# Altium schematic sheet Peripheral.SchDoc
size A3; SheetNumber: 5; SheetTotal: 6; ProjectTitle: PD_SMARTKEY_EMN-EVAN_V2
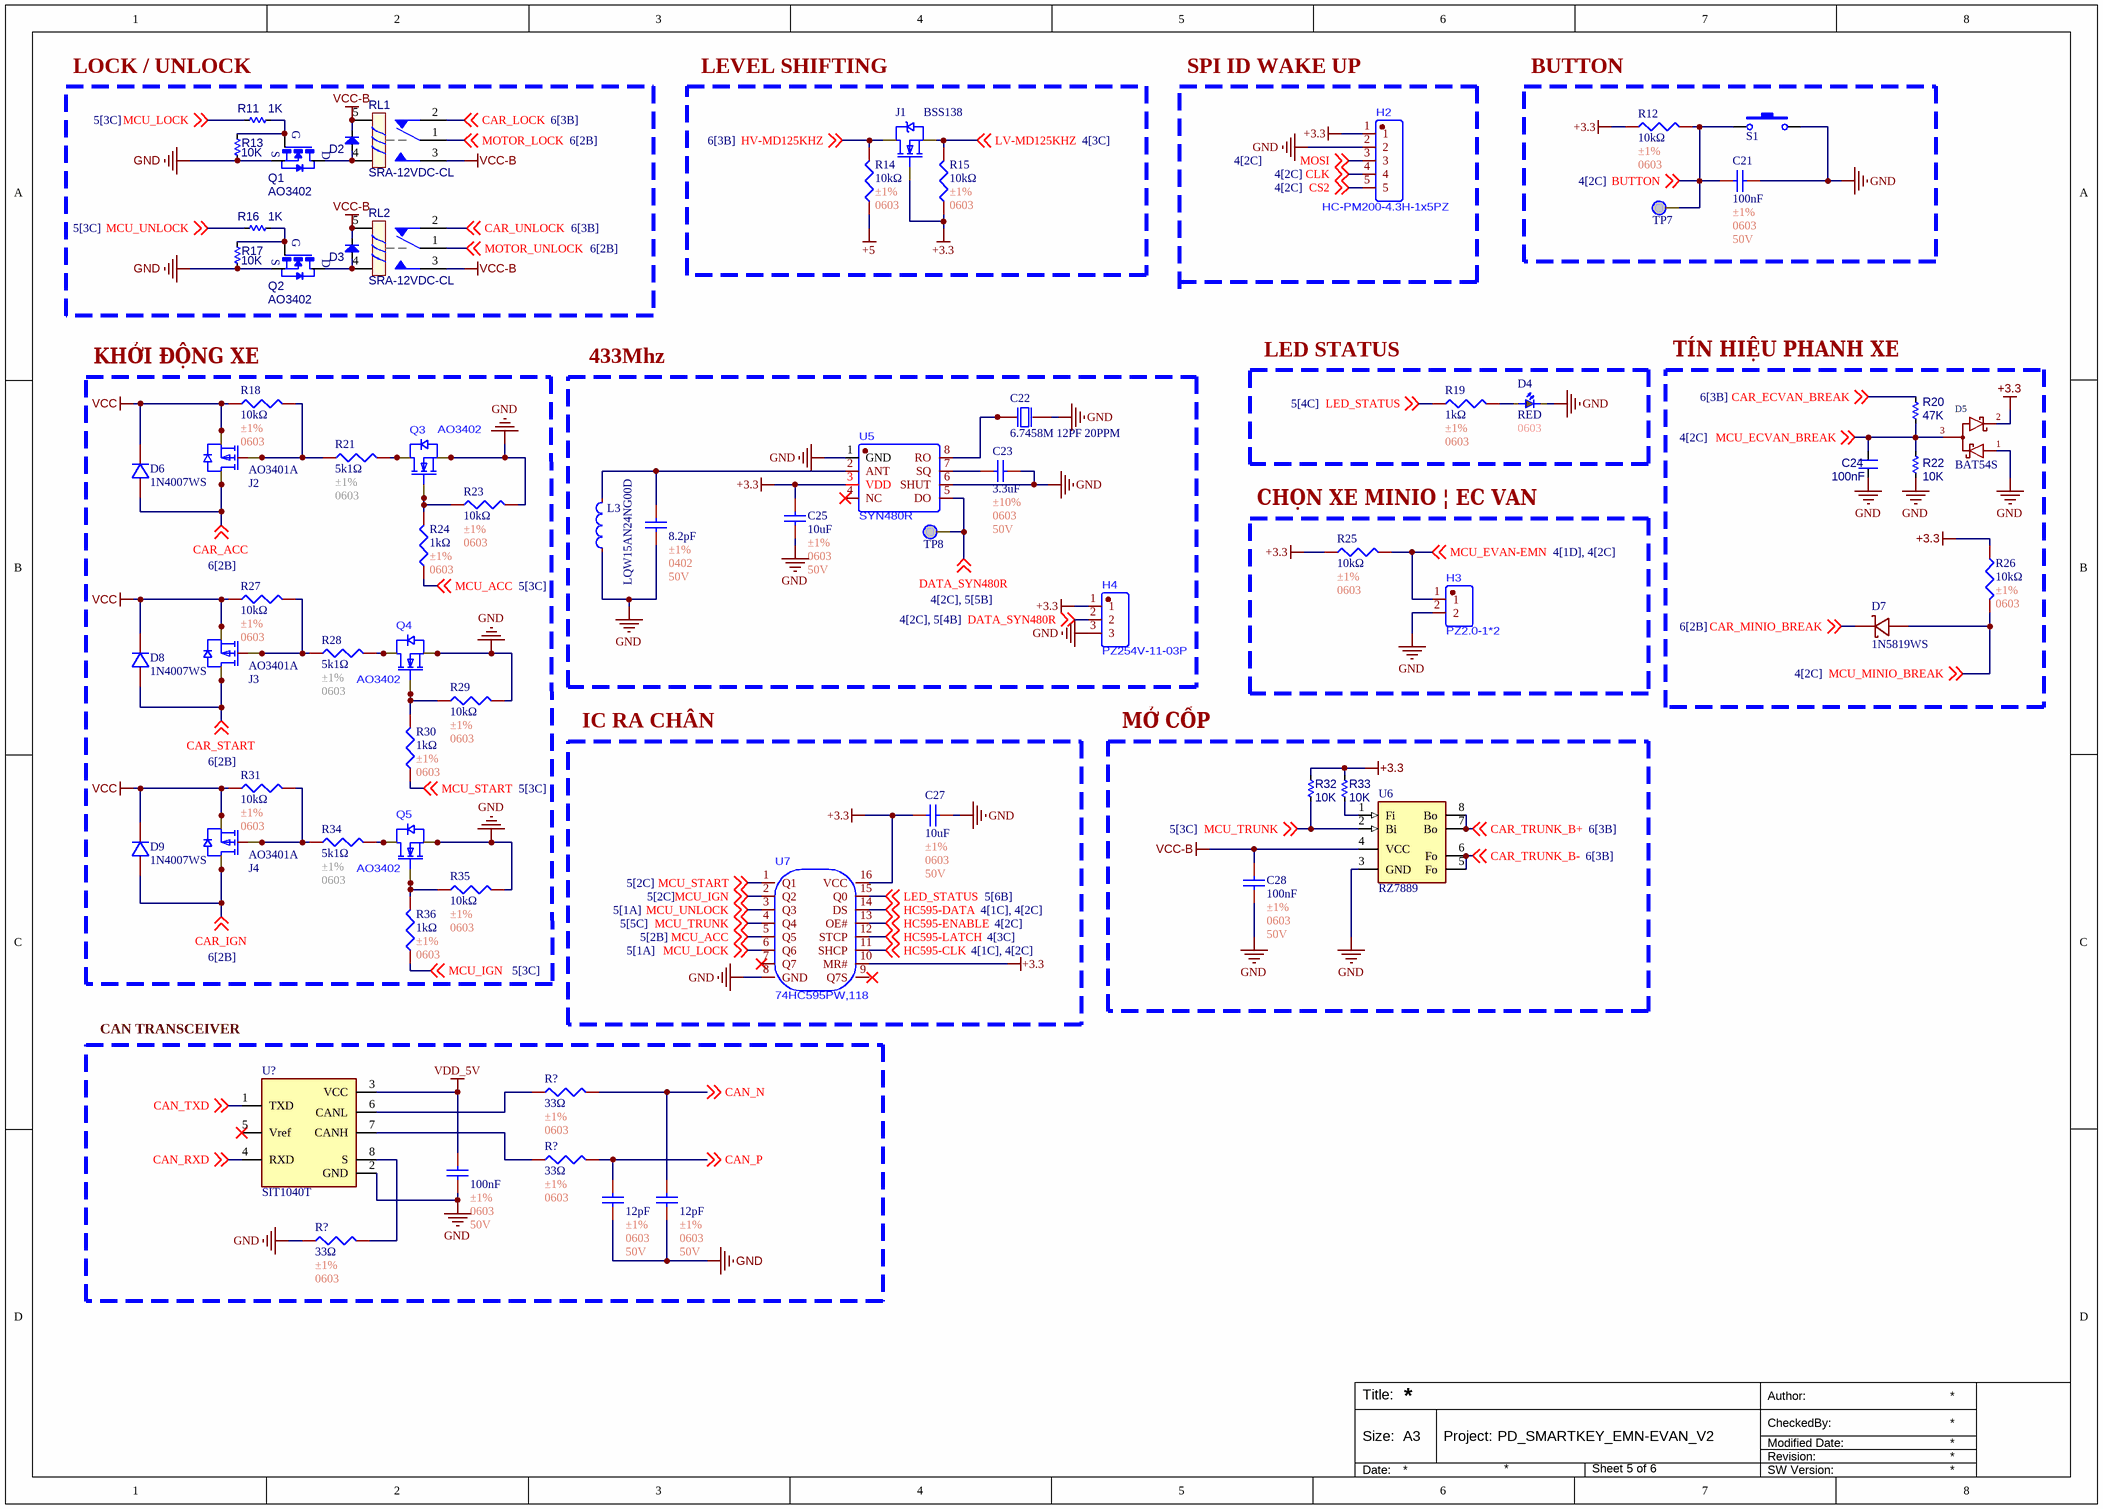
[diagram p0: Peripheral.SchDoc]

## Parts
(Parts that share a designator on the sheet are numbered #1, #2 ... from top to bottom, then left to right.)
C21  100nF  Tolerance: ±1%  Package: 0603  Voltage Rating: 50V  [C0603]
C22  6.7458M 12PF 20PPM  [6.7458M 12PF 20PPM]
C23  3.3uF  Tolerance: ±10%  Package: 0603  Voltage Rating: 50V  [C0603]
C24  100nF  [C-0603]
C25  10uF  Tolerance: ±1%  Package: 0603  Voltage Rating: 50V  [C0603]
C26  8.2pF  Tolerance: ±1%  Package: 0402  Voltage Rating: 50V  [C0402]
C27  10uF  Tolerance: ±1%  Package: 0603  Voltage Rating: 50V  [C0603]
C28  100nF  Tolerance: ±1%  Package: 0603  Voltage Rating: 50V  [C0603]
C?#1  100nF  Tolerance: ±1%  Package: 0603  Voltage Rating: 50V  [C0603]
C?#2  12pF  Tolerance: ±1%  Package: 0603  Voltage Rating: 50V  [C0603]
C?#3  12pF  Tolerance: ±1%  Package: 0603  Voltage Rating: 50V  [C0603]
D2  1N5819  [SOD-323]  (value not drawn)
D3  1N5819  [SOD-323]  (value not drawn)
D4  RED  Package: 0603  [LED0603]
D5  BAT54S  [SOT23-3]
D6  1N4007WS  [1N4007WS]
D7  1N5819WS  [1N5819WS]
D8  1N4007WS  [1N4007WS]
D9  1N4007WS  [1N4007WS]
H2  HC-PM200-4.3H-1x5PZ  [JC_5P_XH2.0]
H3  PZ2.0-1*2  [JC_2P_XH2.0]
H4  PZ254V-11-03P  [PZ254V-11-03P]
J1  BSS138  [BSS138]
J2  AO3401A  [AO3401]
J3  AO3401A  [AO3401]
J4  AO3401A  [AO3401]
L3  LQW15AN24NG00D  [LQW15AN24NG00D]
Q1  AO3402  [SOT23-3]
Q2  AO3402  [SOT23-3]
Q3  AO3402  [AO3402]
Q4  AO3402  [AO3402]
Q5  AO3402  [AO3402]
R11  1K  [RES-SMD-0603]
R12  10kΩ  Tolerance: ±1%  Package: 0603  [R0603]
R13  10K  [RES-SMD-0603]
R14  10kΩ  Tolerance: ±1%  Package: 0603  [R0603]
R15  10kΩ  Tolerance: ±1%  Package: 0603  [R0603]
R16  1K  [RES-SMD-0603]
R17  10K  [RES-SMD-0603]
R18  10kΩ  Tolerance: ±1%  Package: 0603  [R0603]
R19  1kΩ  Tolerance: ±1%  Package: 0603  [R0603]
R20  47K  [RES-SMD-0603]
R21  5k1Ω  Tolerance: ±1%  Package: 0603  [R0603]
R22  10K  [RES-SMD-0603]
R23  10kΩ  Tolerance: ±1%  Package: 0603  [R0603]
R24  1kΩ  Tolerance: ±1%  Package: 0603  [R0603]
R25  10kΩ  Tolerance: ±1%  Package: 0603  [R0603]
R26  10kΩ  Tolerance: ±1%  Package: 0603  [R0603]
R27  10kΩ  Tolerance: ±1%  Package: 0603  [R0603]
R28  5k1Ω  Tolerance: ±1%  Package: 0603  [R0603]
R29  10kΩ  Tolerance: ±1%  Package: 0603  [R0603]
R30  1kΩ  Tolerance: ±1%  Package: 0603  [R0603]
R31  10kΩ  Tolerance: ±1%  Package: 0603  [R0603]
R32  10K  [RES-SMD-0603]
R33  10K  [RES-SMD-0603]
R34  5k1Ω  Tolerance: ±1%  Package: 0603  [R0603]
R35  10kΩ  Tolerance: ±1%  Package: 0603  [R0603]
R36  1kΩ  Tolerance: ±1%  Package: 0603  [R0603]
R?#1  33Ω  Tolerance: ±1%  Package: 0603  [R0603]
R?#2  33Ω  Tolerance: ±1%  Package: 0603  [R0603]
R?#3  33Ω  Tolerance: ±1%  Package: 0603  [R0603]
RL1  SRA-12VDC-CL  [YL318-DC12V-C]
RL2  SRA-12VDC-CL  [YL318-DC12V-C]
S1  SW-SMD  [SW-SMD]  (value not drawn)
TP7  TP  [TP]  (value not drawn)
TP8  TP  [TP]  (value not drawn)
U5  SYN480R  [SYN480R]
U6  RZ7889  [SO8]
U7  74HC595PW,118  [74HC595PW,118]
U?  SIT1040T  [SO8]

## Blocks framed on the sheet
LOCK / UNLOCK: D2 D3 Q1 Q2 R11 R13 R16 R17 RL1 RL2
LEVEL SHIFTING: J1 R14 R15
BUTTON: C21 R12 S1 TP7
KHỞI ĐỘNG XE: D6 D8 D9 J2-J4 Q3-Q5 R18 R21 R23 R24 R27-R31 R34-R36
433Mhz: C22 C23 C25 C26 H4 L3 TP8 U5
TÍN HIỆU PHANH XE: C24 D5 D7 R20 R22 R26
CHỌN XE MINIO | EC VAN: H3 R25
IC RA CHÂN: C27 U7
MỞ CỐP: C28 R32 R33 U6
CAN TRANSCEIVER: C?#1-C?#3 R?#1-R?#3 U?

## Nets
+3.3: C25.1 C27.1 D5.2(C) H2.1 H4.1 J1.1(G) R12.1 R15.1 R25.1 R26.1 R32.1 R33.1 U5.3(VDD) U7.10(MR#) U7.16(VCC)
+5: R14.1
GND: C21.1 C22.2(OSC2) C23.1 C24.1 C25.2 C26.2 C27.2 C28.2 C?#1.2 C?#2.2 C?#3.2 D4.1 D5.1(A) H2.2 H3.2 H4.3 L3.1 Q1.2(S) Q2.2(S) Q3.2(S) Q4.2(S) Q5.2(S) R13.1 R17.1 R22.1 R23.2 R29.2 R35.2 R?#3.1 S1.2 U5.1(GND) U5.6(SHUT) U6.3(GND) U7.8(GND) U?.2(GND)
VCC: D6.1(K) D8.1(K) D9.1(K) J2.2(S) J3.2(S) J4.2(S) R18.1 R27.1 R31.1
VCC-B: C28.1 D2.2(K) D3.2(K) RL1.3 RL1.5 RL2.3 RL2.5 U6.4(VCC)
VDD_5V: C?#1.1 U?.3(VCC)
BUTTON: C21.2 R12.2 S1.1 TP7.1 ; off-sheet BUTTON
CAN_N: C?#3.1 R?#1.2 ; off-sheet CAN_N
CAN_P: C?#2.1 R?#2.2 ; off-sheet CAN_P
CAN_RXD: U?.4(RXD) ; off-sheet CAN_RXD
CAN_TXD: U?.1(TXD) ; off-sheet CAN_TXD
CAR_ACC: D6.2(A) J2.3(D) ; off-sheet CAR_ACC
CAR_ECVAN_BREAK: R20.2 ; off-sheet CAR_ECVAN_BREAK
CAR_IGN: D9.2(A) J4.3(D) ; off-sheet CAR_IGN
CAR_LOCK: RL1.2 ; off-sheet CAR_LOCK
CAR_MINIO_BREAK: D7.1(K) ; off-sheet CAR_MINIO_BREAK
CAR_START: D8.2(A) J3.3(D) ; off-sheet CAR_START
CAR_TRUNK_B+: U6.7(Bo) U6.8(Bo) ; off-sheet CAR_TRUNK_B+
CAR_TRUNK_B-: U6.5(Fo) U6.6(Fo) ; off-sheet CAR_TRUNK_B-
CAR_UNLOCK: RL2.2 ; off-sheet CAR_UNLOCK
CLK: H2.4 ; off-sheet CLK
CS2: H2.5 ; off-sheet CS2
DATA_SYN480R: H4.2 TP8.1 U5.5(DO) ; off-sheet DATA_SYN480R
HC595-CLK: U7.11(SHCP) ; off-sheet HC595-CLK
HC595-DATA: U7.14(DS) ; off-sheet HC595-DATA
HC595-ENABLE: U7.13(OE#) ; off-sheet HC595-ENABLE
HC595-LATCH: U7.12(STCP) ; off-sheet HC595-LATCH
HV-MD125KHZ: J1.3(D) R14.2 ; off-sheet HV-MD125KHZ
LED_STATUS: R19.1 U7.15(Q0) ; off-sheet LED_STATUS
LV-MD125KHZ: J1.2(S) R15.2 ; off-sheet LV-MD125KHZ
MCU_ACC: R24.1 U7.5(Q5) ; off-sheet MCU_ACC
MCU_ECVAN_BREAK: C24.2 D5.3 R20.1 R22.2 ; off-sheet MCU_ECVAN_BREAK
MCU_EVAN-EMN: H3.1 R25.2 ; off-sheet MCU_EVAN-EMN
MCU_IGN: R36.1 U7.2(Q2) ; off-sheet MCU_IGN
MCU_LOCK: R11.2 U7.6(Q6) ; off-sheet MCU_LOCK
MCU_MINIO_BREAK: D7.2(A) R26.2 ; off-sheet MCU_MINIO_BREAK
MCU_START: R30.1 U7.1(Q1) ; off-sheet MCU_START
MCU_TRUNK: R32.2 U6.2(Bi) U7.4(Q4) ; off-sheet MCU_TRUNK
MCU_UNLOCK: R16.2 U7.3(Q3) ; off-sheet MCU_UNLOCK
MOSI: H2.3 ; off-sheet MOSI
MOTOR_LOCK: RL1.1 ; off-sheet MOTOR_LOCK
MOTOR_UNLOCK: RL2.1 ; off-sheet MOTOR_UNLOCK
NetC22_1: C22.1(OSC1) U5.8(RO)
NetC23_2: C23.2 U5.7(SQ)
NetC26_1: C26.1 L3.2 U5.2(ANT)
NetD2_1: D2.1(A) Q1.3(D) RL1.4
NetD3_1: D3.1(A) Q2.3(D) RL2.4
NetD4_2: D4.2 R19.2
NetJ2_1: J2.1(G) R18.2 R21.1
NetJ3_1: J3.1(G) R27.2 R28.1
NetJ4_1: J4.1(G) R31.2 R34.1
NetQ1_1: Q1.1(G) R11.1 R13.2
NetQ2_1: Q2.1(G) R16.1 R17.2
NetQ3_1: Q3.1(G) R23.1 R24.2
NetQ3_3: Q3.3(D) R21.2
NetQ4_1: Q4.1(G) R29.1 R30.2
NetQ4_3: Q4.3(D) R28.2
NetQ5_1: Q5.1(G) R35.1 R36.2
NetQ5_3: Q5.3(D) R34.2
NetR33_2: R33.2 U6.1(Fi)
NetR?#1_1: R?#1.1 U?.6(CANL)
NetR?#2_1: R?#2.1 U?.7(CANH)
NetR?#3_2: R?#3.2 U?.8(S)

Not connected (* = marked no-connect by the designer): U5 4(NC)*; U7 7(Q7)* 9(Q7S); U? 5(Vref)*

## Notes on the sheet
- SPI ID WAKE UP
- LED STATUS
- Author:
- Title:
- Size:
- A3
- Project:
- Revision:
- Modified Date:
- CheckedBy:
- Date:
- SW Version:

## Library data of the parts
C21 C28 = C0603_100nF_±1%: Manufacturer: YAGEO; Mfr. Part #: CC0402FRNPO9BN100; LCSC Part #: C513681; Link: https://www.lcsc.com/product-detail/C513681.html?s_z=n_capital%2520yageo%252010pF%25200402; Capacitance: 100nF
C22 = 6.7458M 12PF 20PPM: CRYSTAL 6.7458MHz 12pF SMD; Manufacturer: SOSET; Load Capacitance: 20pF; Mfr. Part #: 6.7458M 12PF 20PPM; LCSC Part #: C4944008; Package: HC-49S-SMD-2P-Mini; Link: https://www.lcsc.com/product-detail/C4944008.html?utm_source=chatgpt.com
C23 = C0603_3.3uF_±10%: Manufacturer: muRata; Mfr. Part #: GCJ188C70J335KE02D; Temperature Coefficient: X7S; LCSC Part #: C710616; Link: https://www.lcsc.com/product-detail/C710616.html?s_z=n_Capita%25200603%25203.3uF%2520yageo; Capacitance: 3.3uF
C24 = CM: Cap SMD; Value: 103
C25 C27 = C0603_10uF_±1%: Manufacturer: YAGEO; Mfr. Part #: CC0402FRNPO9BN100; LCSC Part #: C513681; Link: https://www.lcsc.com/product-detail/C513681.html?s_z=n_capital%2520yageo%252010pF%25200402; Capacitance: 10uF
C26 = C0402_10pF_±1%: 50V 10pF NP0 ±1% 0402 Multilayer Ceramic Capacitors MLCC - SMD/SMT ROHS; Manufacturer: YAGEO; Mfr. Part #: CC0402FRNPO9BN100; LCSC Part #: C513681; Link: https://www.lcsc.com/product-detail/C513681.html?s_z=n_capital%2520yageo%252010pF%25200402; Capacitance: 10pF
C?#1 = C0603_100nF_±1%: 50V 10pF NP0 ±1% 0402 Multilayer Ceramic Capacitors MLCC - SMD/SMT ROHS; Manufacturer: YAGEO; Mfr. Part #: CC0402FRNPO9BN100; LCSC Part #: C513681; Link: https://www.lcsc.com/product-detail/C513681.html?s_z=n_capital%2520yageo%252010pF%25200402; Capacitance: 100nF
C?#2 C?#3 = C0603_12pF_±1%: 50V 10pF NP0 ±1% 0402 Multilayer Ceramic Capacitors MLCC - SMD/SMT ROHS; Manufacturer: YAGEO; Mfr. Part #: CC0402FRNPO9BN100; LCSC Part #: C513681; Link: https://www.lcsc.com/product-detail/C513681.html?s_z=n_capital%2520yageo%252010pF%25200402; Capacitance: 12pF
D2 D3 = Diode SMD: Default Diode; Code - JEDEC: DO-214-AB; Value: 1N5007; Published: 8-Jun-2000; Revision: July-2002: Re-released for DXP Platform.; Publisher: Altium Limited
D4 = D0603_RED: 25mcd~40mcd Water Clear -40℃~+85℃ 624nm Red 120° 60mW 0402 LED Indication - Discrete ROHS; Manufacturer: XINGLIGHT; Mfr. Part #: XL-1005UGC; Voltage - Forward(Vf): 3V; LCSC Part #: C965793; Power(Watts): 60mW; Link: https://www.lcsc.com/product-detail/C136765.html?s_z=n_LED%25200402%2520RED; Illumination Color: RED
D5 = Schottky Dual Diode SMD: Diode 30V 0.2A Surface Mount SOT-23; ki_keywords: Dual Schottky Diode Series; ki_description: Dual Schottky Diode in Series; Datasheet: https://diotec.com/request/datasheet/bat54.pdf
D6 D8 D9 = 1N4007WS: DIODE STANDARD 1kV 1A SOD-323; Manufacturer: MDD(Microdiode Semiconductor); Mfr. Part #: 1N4007WS; LCSC Part #: C193404; Package: SOD-323; Link: https://www.lcsc.com/product-detail/C193404.html?utm_source=chatgpt.com
D7 = 1N5819WS: DIODE SCHOTTKY 40V SOD-323; Manufacturer: Guangdong Hottech; Mfr. Part #: 1N5819WS; LCSC Part #: SOD-323; Package: SOD-323; Link: https://www.lcsc.com/product-detail/C191023.html?s_z=n_q_t_1n5819&spm=wm.fly.bg.0.xh___wm.ssy.tc.0.tz&lcsc_vid=FFlaVlZURFlbX1EAE1lbUlZfQwdeBlBRQ1VZBFdQQwUxVlNeQ1RdUFFfRVVZVDsOAxUeFF5JWBYZEEoKFBINSQcJGk4eFQsCAgIaSgADAwAHC0slRFJfVVJQRE8GEwkK
H2 = JC_5P_XH2.0X_: CONN SOCKET 5POS 2mm SINGLE ROW TH; Manufacturer: Hong Cheng; MPN: HC-PM200-4.3H-1x5PZ; LCSC Part #: C22436139; Packaging: Through Hole,P=2mm; Link: https://www.lcsc.com/product-detail/C22436139.html?utm_source=chatgpt.com
H3 = JC_2P_XH2.54: CONN HEADER 2POS 2mm SINGLE ROW TH; Manufacturer: ZHOURI; MPN: PZ2.0-1*2; LCSC Part #: C5224022; Packaging: Through Hole,P=2mm; Link: https://www.lcsc.com/product-detail/C5224022.html?utm_source=chatgpt.com
H4 = PZ254V-11-03P: CONN HEADER 3POS 2.54mm SINGLE ROW TH; Manufacturer: XFCN; MPN: PZ254V-11-03P; LCSC Part #: C2937625; Packaging: Through Hole,P=2.54mm; Link: https://www.lcsc.com/product-detail/C2937625.html?s_z=n_q_t_header%25203%2520Position&spm=wm.fly.bg.3.xh___wm.ssy.tc.0.tz&lcsc_vid=FlRcBlcDRFNZAlJQT1RZBVJSEVFcX11eRVQPBFEHFgAxVlNeQVVaV1BSRFVfXjsOAxUeFF5JWBYZEEoKFBINSQcJGk4dAgUUFAk%3D
J1 = BSS138: MOSFET N-CH 50V 0.22A SOT-23; Manufacturer: onsemi; Mfr. Part #: BSS138; LCSC Part #: C52895; Package: SOT-23; Link: https://www.lcsc.com/product-detail/C52895.html?s_z=n_q_x_bss138&spm=wm.ssy.em.0.tz&lcsc_vid=FFlaVlZURFlbX1EAE1lbUlZfQwdeBlBRQ1VZBFdQQwUxVlNeQlVeVVZeQlBWUTsOAxUeFF5JWBYZEEoKFBINSQcJGk4eFQsCAgIaSgADAwAHC0slTlBeX1dIHxUDCw%3D%3D
J2-J4 = AO3401: 30V 4A 900mV@250uA 1 P-Channel SOT-23 MOSFETs ROHS; Manufacturer: AOS; Mfr. Part #: AO3401A; LCSC Part #: C15127; Package: SOT-23; Current - Continuous Drain(Id): 4A; Drain to Source Voltage: 30V; Link: https://www.lcsc.com/product-detail/C15127.html?s_z=n_AO3401
L3 = LQW15AN24NG00D: FIXED IND 24nH 280mA 520mΩ 0402; Manufacturer: muRata; Mfr. Part #: LQW15AN24NG00D; LCSC Part #: C167472; Package: 0402; Link: https://www.lcsc.com/product-detail/C167472.html?s_z=n_q_inductor%252024nH%25200402&spm=wm.fly.bg.0.xh&lcsc_vid=FlRcBlcDRFNZAlJQT1RZBVJSEVFcX11eRVQPBFEHFgAxVlNeQVRfUFJVQVNZUzsOAxUeFF5JWBYZEEoKFBINSQcJGk4eFQsCAgIaSgADAwAHC0slRlhdU1RSWQkaCgg%3D
Q1 Q2 = SI2302DS: N-Channel 20V 2.5A _Tc_ 830mW _Tc_ Surface Mount TO-236AB _SOT23_; MF: NXP Semiconductors; SnapEDA_Link: https://www.snapeda.com/parts/SI2302DS/NXP%20Semiconductors/view-part/4701514/?ref=snap; Availability: Unavailable; MP: SI2302DS; Price: None; Value: *; Package: None
Q3-Q5 = AO3402: MOSFET N-CH 30V SOT-23; Manufacturer: AOS; MPN: AO3402; LCSC Part #: C14385; Packaging: SOT-23; Link: https://www.lcsc.com/product-detail/C14385.html?s_z=n_q_ao3402&spm=wm.fly.bg.0.xh&lcsc_vid=FFlaVlZURFlbX1EAE1lbUlZfQwdeBlBRQ1VZBFdQQwUxVlNeRVZXVF1QQ1BYXzsOAxUeFF5JWBYZEEoKFBINSQcJGk4NBhADEA4cHktXR1FWSQwSGg0%3D
R11 R13 R16 R17 R20 R22 R32 R33 = Res-SMD: Resistor; Manufacturer: Generic Components; Class: Passive; Published: 08/06/2000; Publisher: Altium Hobart Technology Centre
R12 R14 R15 R18 R23 R25-R27 R29 R31 R35 = R0603_10kΩ_±1%: 62.5mW Thick Film Resistor 50V ±1% ±200ppm/℃ 10Ω 0402 Chip Resistor - Surface Mount ROHS; Manufacturer: YAGEO; Mfr. Part #: RC0402FR-0710RL; LCSC Part #: C138066; Resistance: 10kΩ; Link: https://www.lcsc.com/product-detail/C138066.html?s_z=n_resistor%25200402%252010R
R19 R24 R30 R36 = R0603_1kΩ_±1%: 62.5mW Thick Film Resistor 50V ±1% ±200ppm/℃ 10Ω 0402 Chip Resistor - Surface Mount ROHS; Manufacturer: YAGEO; Mfr. Part #: RC0402FR-0710RL; LCSC Part #: C138066; Resistance: 1kΩ; Link: https://www.lcsc.com/product-detail/C138066.html?s_z=n_resistor%25200402%252010R
R21 R28 R34 = R0603_5k1Ω_±1%: 100mW Thick Film Resistor 75V ±100ppm/℃ ±1% 5.1kΩ 0603 Chip Resistor - Surface Mount ROHS; Manufacturer: FOJAN; Mfr. Part #: FRC0603F5101TS; Key Attributes: RES 5.1kΩ ±1% 100mW 0603; LCSC Part #: C2907044; Link: https://www.lcsc.com/product-detail/C2907044.html?s_z=n_5k1%25200603; Resistance: 5k1Ω
R?#1-R?#3 = R0603_33Ω_±5%: 100mW Thick Film Resistor 75V ±1% ±200ppm/℃ 2Ω 0603 Chip Resistor - Surface Mount ROHS; Manufacturer: YAGEO; Mfr. Part #: RC0603FR-072RL; Key Attributes: RES 0Ω ±5% 100mW 0603; LCSC Part #: C185341; Resistance: 33Ω; Link: https://www.lcsc.com/product-detail/C185341.html?s_z=n_resistor%2520yageo%25202%25CE%25A9%25200603
RL1 RL2 = Relay 1: Relay SPDT,10A - 12VDC 5 Pin; Value: Relay SPDT, 10A, 12V
S1 = SW-SMD: Switch; Published: 24-Mar-1999; LatestRevisionDate: 17-Jul-2002; LatestRevisionNote: Re-released for DXP Platform.; PackageReference: SPST-2; Publisher: Altium Limited
U5 = SYN480R: 433/315 MHz wireless receiver chips; Manufacturer: JSMSEMI; MPN: SYN480R; LCSC Part #: C916347; Packaging: SOP-8; Link: https://www.lcsc.com/product-detail/C916347.html?s_z=n_q_SYN480R&spm=wm.fly.bg.0.xh&lcsc_vid=FlRcBlcDRFNZAlJQT1RZBVJSEVFcX11eRVQPBFEHFgAxVlNeQVVdUFxQR1VXUDsOAxUeFF5JWBYZEEoKFBINSQcJGk4eFQsCAgIaSgADAwAHC0sRHhMLShAJWgMBBhYCWgIBCQoDFBUBFTsLEgYPFBAHBUwUH0kODlNDV0lVBxYaOCdRQ1NXUlNWWQkaCgg%3D
U6 = RZ7889: RZ7889 is a monolithic IC designed for driving bi-directional DC motor
U7 = 74HC595PW,118: 8-bit serial-in, serial or parallel-out shift register with output latches; 3-state; Manufacturer: Nexperia; MPN: 74HC595PW,118; LCSC Part #: C5948; Packaging: TSSOP-16; Link: https://www.lcsc.com/product-detail/C5948.html?utm_source=chatgpt.com
U? = TJA1050: 1/1 Transceiver Half CANbus 8-SO; MF: NXP USA; Package: SOIC-8 NXP USA; Value: *; Availability: Unavailable; SnapEDA_Link: https://www.snapeda.com/parts/TJA1050/NXP%20USA%20Inc./view-part/562764/?ref=snap; Price: None; MP: TJA1050